# EAGLE design kraken (EAGLE 6.3)
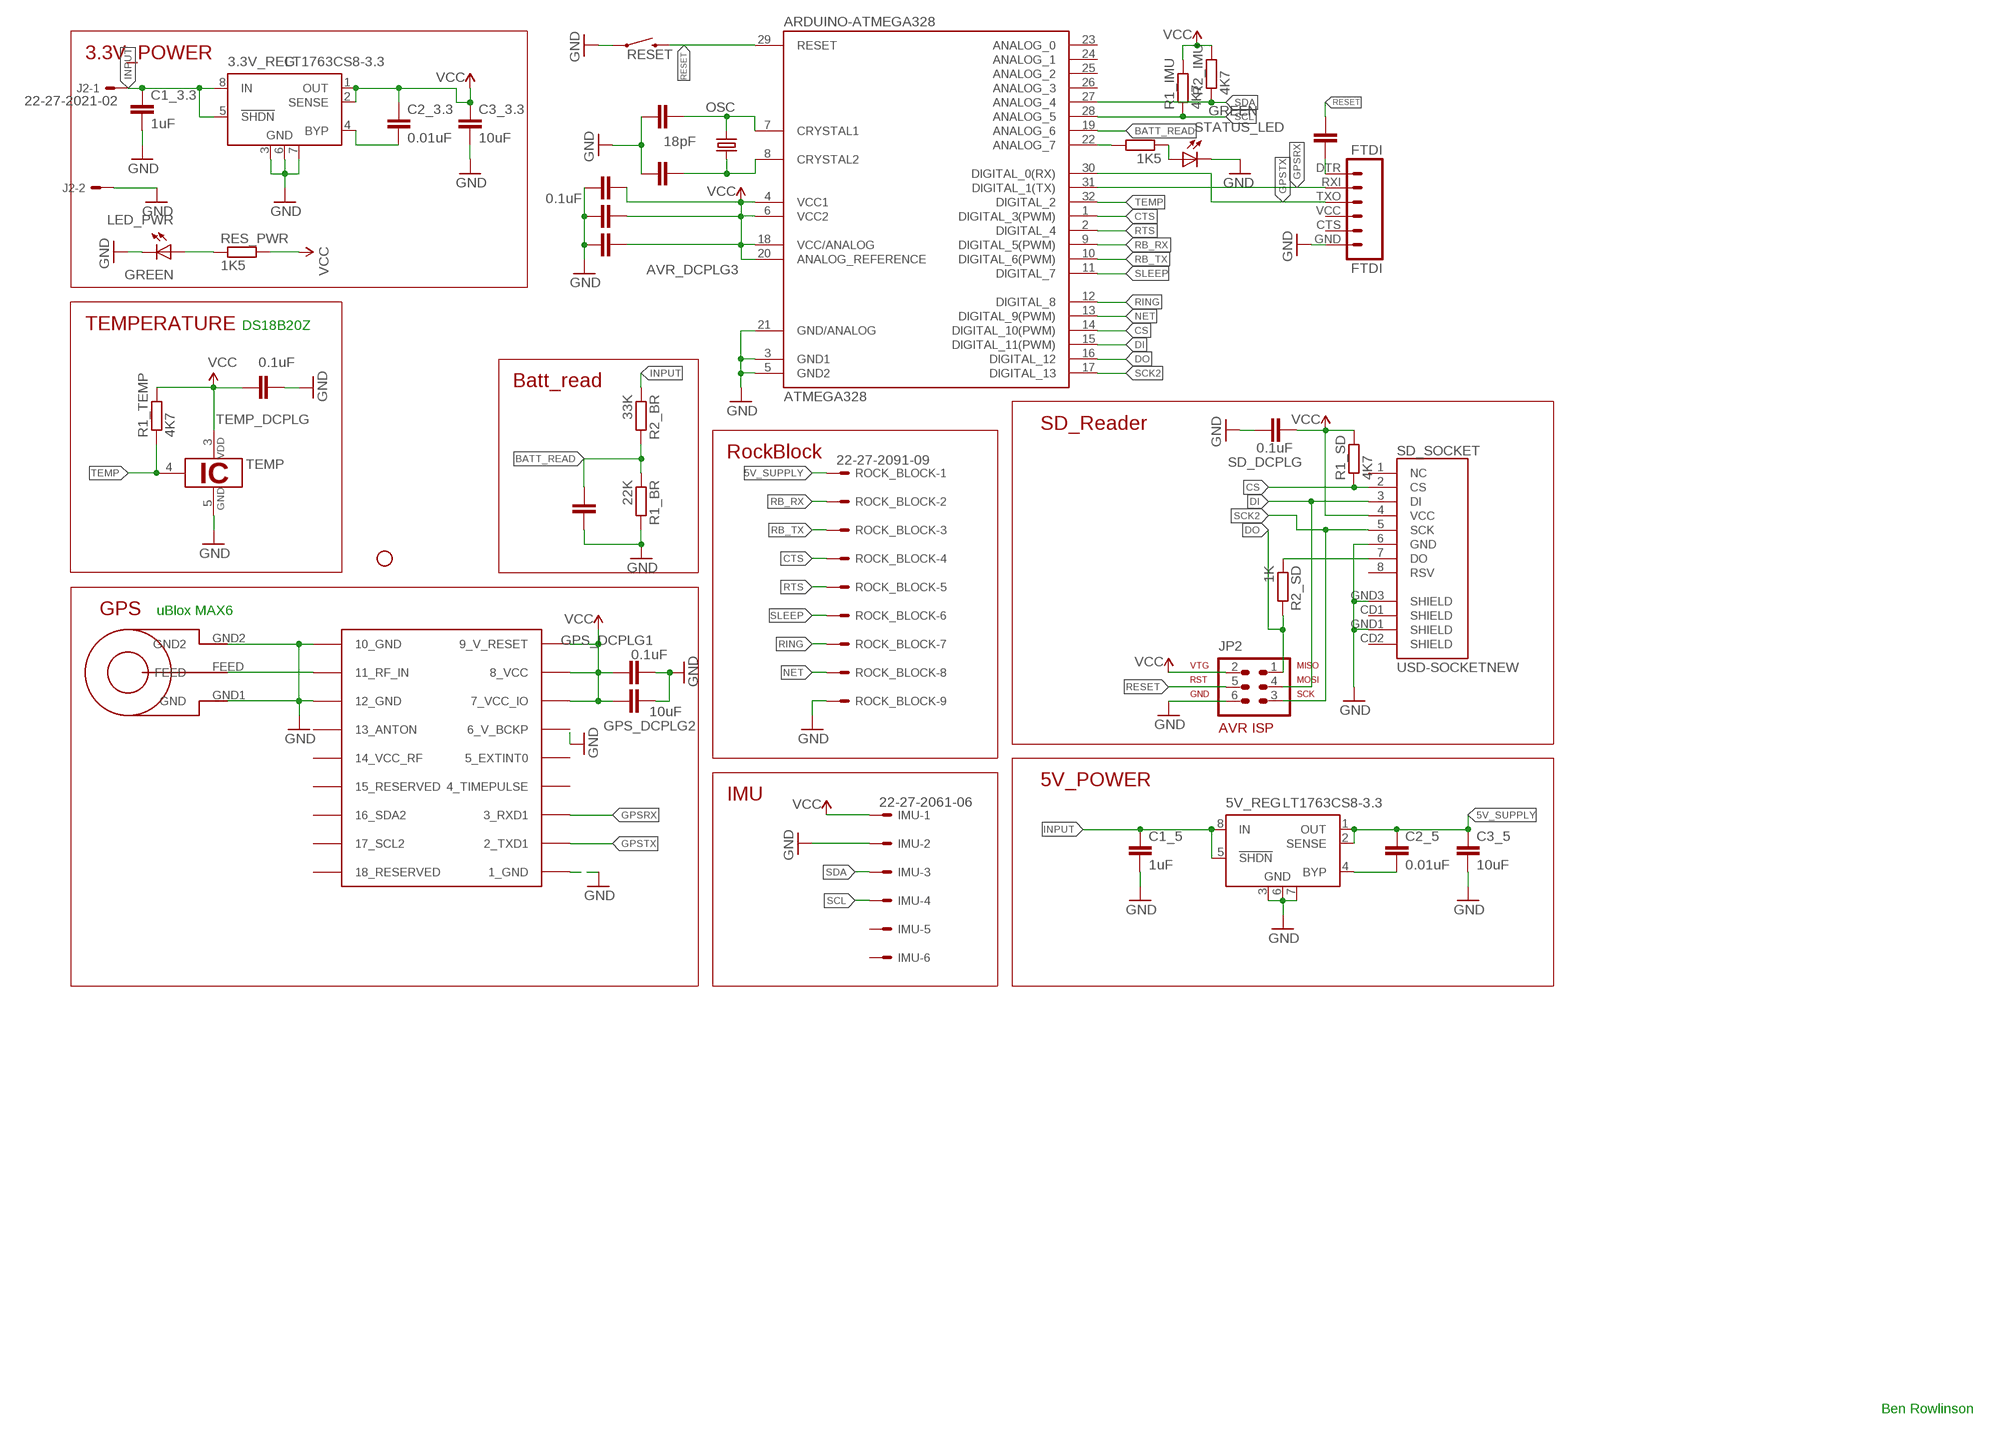
[diagram p0: schematic, sheet 1]

## Parts
3.3V_REG  LT1763CS8-3.3  [SOIC8]
5V_REG  LT1763CS8-3.3  [SOIC8]
ARDUINO-ATMEGA328  ATMEGA328  ATMEGA168-AU  [TQFP32-08]
AVR_DCPLG1  0.1uF  CAP0805  [0805]
AVR_DCPLG2  0.1uF  CAP0805  [0805]
AVR_DCPLG3  0.1uF  CAP0805  [0805]
C1_3.3  1uF  CAP0805  [0805]
C1_5  1uF  CAP0805  [0805]
C1_BR  0.1uF  CAP0805  [0805]
C1_OSC  18pF  CAP0805  [0805]
C2_3.3  0.01uF  CAP0805  [0805]
C2_5  0.01uF  CAP0805  [0805]
C2_OSC  18pF  CAP0805  [0805]
C3_3.3  10uF  CAP0805  [0805]
C3_5  10uF  CAP0805  [0805]
FTDI  FTDI  FTDI_BASICPTH  [FTDI_BASIC]
FTDI_DCPLG  0.1uF  CAP0805  [0805]
GPS_DCPLG1  0.1uF  CAP0805  [0805]
GPS_DCPLG2  10uF  CAP0805  [0805]
IMU  22-27-2061-06  [6410-06]
J2  22-27-2021-02  [6410-02]
JP1  STAND-OFF  [STAND-OFF]
JP2  AVR-ISP-6  [AVR-ISP-6]
LED_PWR  GREEN  LEDCHIPLED_0603  [CHIPLED_0603]
OSC  16MHz  CRYSTAL5X3  [CRYSTAL-SMD-5X3]
R1_BR  22K  R-EU_R0805  [R0805]
R1_IMU  4K7  R-EU_R0805  [R0805]
R1_SD  4K7  R-EU_R0805  [R0805]
R1_TEMP  4K7  R-EU_R0805  [R0805]
R2_BR  33K  R-EU_R0805  [R0805]
R2_IMU  4K7  R-EU_R0805  [R0805]
R2_SD  1K  R-EU_R0805  [R0805]
R_STATUS  1K5  R-EU_R0805  [R0805]
RES_PWR  1K5  R-EU_R0805  [R0805]
RESET  SW-MOMENTARY-SMD  SWITCH-MOMENTARY-2-SMD-1101NE  [TACTILE-SWITCH-1101NE]
ROCK_BLOCK  22-27-2091-09  [6410-09]
SD_DCPLG  0.1uF  CAP0805  [0805]
SD_SOCKET  USD-SOCKETNEW  [MICRO-SD-SOCKET-PP]
STATUS_LED  GREEN  LEDCHIPLED_0603  [CHIPLED_0603]
TEMP  DS18B20Z  [SO08]
TEMP_DCPLG  0.1uF  CAP0805  [0805]
U$1  UBLOX_MAX-6  [UBLOX_MAX-6]
U$2  SARANTEL-SR1202  [SARANTEL-SR1202]

## Nets
5V_SUPPLY: 5V_REG.1(OUT) 5V_REG.2(SENSE) C2_5.1 C3_5.1 ROCK_BLOCK.1
BATT_READ: ARDUINO-ATMEGA328.19(ANALOG_6) C1_BR.2 R1_BR.1 R2_BR.2
CS: ARDUINO-ATMEGA328.14(DIGITAL_10(PWM)) R1_SD.1 SD_SOCKET.2(CS)
CTS: ARDUINO-ATMEGA328.1(DIGITAL_3(PWM)) ROCK_BLOCK.4
DI: ARDUINO-ATMEGA328.15(DIGITAL_11(PWM)) JP2.4 SD_SOCKET.3(DI)
DO: ARDUINO-ATMEGA328.16(DIGITAL_12) JP2.1 R2_SD.2
GND: 3.3V_REG.3(GND) 3.3V_REG.6(GND) 3.3V_REG.7(GND) 5V_REG.3(GND) 5V_REG.6(GND) 5V_REG.7(GND) ARDUINO-ATMEGA328.3(GND1) ARDUINO-ATMEGA328.5(GND2) ARDUINO-ATMEGA328.21(GND/ANALOG) AVR_DCPLG1.1 AVR_DCPLG2.1 AVR_DCPLG3.1 C1_3.3.2 C1_5.2 C1_BR.1 C1_OSC.1 C2_OSC.1 C3_3.3.2 C3_5.2 FTDI.GND GPS_DCPLG1.2 GPS_DCPLG2.2 IMU.2 J2.2 JP2.6 LED_PWR.C R1_BR.2 RESET.P$1 ROCK_BLOCK.9 SD_DCPLG.2 SD_SOCKET.6(GND) SD_SOCKET.GND1(SHIELD) SD_SOCKET.GND3(SHIELD) STATUS_LED.C TEMP.5 TEMP_DCPLG.1 U$1.1_GND U$1.6_V_BCKP U$1.10_GND U$1.12_GND U$2.GND1(GND) U$2.GND2
GPSRX: ARDUINO-ATMEGA328.31(DIGITAL_1(TX)) FTDI.RXI U$1.3_RXD1
GPSTX: ARDUINO-ATMEGA328.30(DIGITAL_0(RX)) FTDI.TXO U$1.2_TXD1
INPUT: 3.3V_REG.5(!SHDN) 3.3V_REG.8(IN) 5V_REG.5(!SHDN) 5V_REG.8(IN) C1_3.3.1 C1_5.1 J2.1 R2_BR.1
N$1: R_STATUS.1 STATUS_LED.A
N$2: R2_SD.1 SD_SOCKET.7(DO)
N$3: LED_PWR.A RES_PWR.1
N$4: ARDUINO-ATMEGA328.22(ANALOG_7) R_STATUS.2
N$5: ARDUINO-ATMEGA328.8(CRYSTAL2) C2_OSC.2 OSC.1
N$6: ARDUINO-ATMEGA328.7(CRYSTAL1) C1_OSC.2 OSC.3
N$7: 3.3V_REG.4(BYP) C2_3.3.2
N$8: U$1.11_RF_IN U$2.FEED
N$10: 5V_REG.4(BYP) C2_5.2
N$14: FTDI.DTR FTDI_DCPLG.2
NET: ARDUINO-ATMEGA328.13(DIGITAL_9(PWM)) ROCK_BLOCK.8
RB_RX: ARDUINO-ATMEGA328.9(DIGITAL_5(PWM)) ROCK_BLOCK.2
RB_TX: ARDUINO-ATMEGA328.10(DIGITAL_6(PWM)) ROCK_BLOCK.3
RESET: ARDUINO-ATMEGA328.29(RESET) FTDI_DCPLG.1 JP2.5 RESET.P$2
RING: ARDUINO-ATMEGA328.12(DIGITAL_8) ROCK_BLOCK.7
RTS: ARDUINO-ATMEGA328.2(DIGITAL_4) ROCK_BLOCK.5
SCK2: ARDUINO-ATMEGA328.17(DIGITAL_13) JP2.3 SD_SOCKET.5(SCK)
SCL: ARDUINO-ATMEGA328.28(ANALOG_5) IMU.4 R1_IMU.1
SDA: ARDUINO-ATMEGA328.27(ANALOG_4) IMU.3 R2_IMU.1
SLEEP: ARDUINO-ATMEGA328.11(DIGITAL_7) ROCK_BLOCK.6
TEMP: ARDUINO-ATMEGA328.32(DIGITAL_2) R1_TEMP.1 TEMP.4
VCC: 3.3V_REG.1(OUT) 3.3V_REG.2(SENSE) ARDUINO-ATMEGA328.4(VCC1) ARDUINO-ATMEGA328.6(VCC2) ARDUINO-ATMEGA328.18(VCC/ANALOG) ARDUINO-ATMEGA328.20(ANALOG_REFERENCE) AVR_DCPLG1.2 AVR_DCPLG2.2 AVR_DCPLG3.2 C2_3.3.1 C3_3.3.1 GPS_DCPLG1.1 GPS_DCPLG2.1 IMU.1 JP2.2 R1_IMU.2 R1_SD.2 R1_TEMP.2 R2_IMU.2 RES_PWR.2 SD_DCPLG.1 SD_SOCKET.4(VCC) TEMP.3 TEMP_DCPLG.2 U$1.7_VCC_IO U$1.8_VCC U$1.9_V_RESET
Unconnected: ARDUINO-ATMEGA328.23(ANALOG_0) ARDUINO-ATMEGA328.24(ANALOG_1) ARDUINO-ATMEGA328.25(ANALOG_2) ARDUINO-ATMEGA328.26(ANALOG_3) FTDI.CTS FTDI.VCC IMU.5 IMU.6 SD_SOCKET.1(NC) SD_SOCKET.8(RSV) SD_SOCKET.CD1(SHIELD) SD_SOCKET.CD2(SHIELD) U$1.4_TIMEPULSE U$1.5_EXTINT0 U$1.13_ANTON U$1.14_VCC_RF U$1.15_RESERVED U$1.16_SDA2 U$1.17_SCL2 U$1.18_RESERVED

## Notes on the sheet
- 3.3V_POWER
- TEMPERATURE | DS18B20Z
- Batt_read
- SD_Reader
- RockBlock
- GPS | uBlox MAX6
- 5V_POWER
- IMU
- Ben Rowlinson

## Library data of the parts
3.3V_REG 5V_REG = linear-technology:LT1763CS8: 500mA, Low Noise, LDO Micropower Regulators Source: http://cds.linear.com/docs/Datasheet/1763ff.pdf; MPN: LT1763CS8-3.3; OC_FARNELL: 1273617; OC_NEWARK: 57M6055
ARDUINO-ATMEGA328 = Arduino-AVR:ATMEGA168
AVR_DCPLG1-AVR_DCPLG3 C1_BR C1_OSC C2_OSC FTDI_DCPLG GPS_DCPLG1 GPS_DCPLG2 SD_DCPLG TEMP_DCPLG = SparkFun:CAP: Capacitor Standard 0603 ceramic capacitor, and 0.1" leaded capacitor.
C1_3.3 C1_5 C2_3.3 C2_5 C3_3.3 C3_5 = apex:CAP: Capacitor Standard 0603 ceramic capacitor, and 0.1" leaded capacitor.
FTDI = apex:FTDI_BASIC: FTDI Basic: 3.3V and 5V
IMU = apex:22-?-06: CONNECTOR wire to board 2.54 mm (.1 inch) pitch header; OC_FARNELL: unknown; OC_NEWARK: unknown
J2 = apex:22-?-02: CONNECTOR wire to board 2.54 mm (.1 inch) pitch header; OC_FARNELL: unknown; OC_NEWARK: unknown
JP1 = apex:STAND-OFF: Stand Off This is the mechanical footprint for a #4 phillips button head screw. Use the keepout ring to avoid running the screw head into surrounding components. SKU : PRT-00447
JP2 = apex:AVR-ISP-6: AVR ISP-6 Serial Programming Header
LED_PWR STATUS_LED = led:LED: LED OSRAM: - CHIPLED LG R971, LG N971, LY N971, LG Q971, LY Q971, LO R971, LY R971 LH N974, LH R974 LS Q976, LO Q976, LY Q976 LO Q996 - Hyper CHIPLED LW Q18S LB Q993, LB Q99A, LB R99A - SideLED LS A670, LO A670, LY A670, LG A670, LP A670 LB A673, LV A673, LT A673, LW A673 LH A674 LY A675 LS A676, LA A676, LO A676, LY A676, LW A676 LS A679, LY A679, LG A679 - Hyper Micro SIDELED® LS Y876, LA Y876, LO Y876, LY Y876 LT Y87S - SmartLED LW L88C, LW L88S LB L89C, LB L89S, LG L890 LS L89K, LO L89K, LY L89K LS L896, LA L896, LO L896, LY L896 - TOPLED LS T670, LO T670, LY T670, LG T670, LP T670 LSG T670, LSP T670, LSY T670, LOP T670, LYG T670 LG T671, LOG T671, LSG T671 LB T673, LV T673, LT T673, LW T673 LH T674 LS T676, LA T676, LO T676, LY T676, LB T676, LH T676, LSB T676, LW T676 LB T67C, LV T67C, LT T67C, LS T67K, LO T67K, LY T67K, LW E67C LS E67B, LA E67B, LO E67B, LY E67B, LB E67C, LV E67C, LT E67C LW T67C LS T679, LY T679, LG T679 LS T770, LO T770, LY T770, LG T770, LP T770 LB T773, LV T773, LT T773, LW T773 LH T774 LS E675, LA E675, LY E675, LS T675 LS T776, LA T776, LO T776, LY T776, LB T776 LHGB T686 LT T68C, LB T68C - Hyper Mini TOPLED® LB M676 - Mini TOPLED Santana® LG M470 LS M47K, LO M47K, LY M47K Source: http://www.osram.convergy.de LUXEON: - LUMILED® LXK2-PW12-R00, LXK2-PW12-S00, LXK2-PW14-U00, LXK2-PW14-V00 LXK2-PM12-R00, LXK2-PM12-S00, LXK2-PM14-U00 LXK2-PE12-Q00, LXK2-PE12-R00, LXK2-PE12-S00, LXK2-PE14-T00, LXK2-PE14-U00 LXK2-PB12-K00, LXK2-PB12-L00, LXK2-PB12-M00, LXK2-PB14-N00, LXK2-PB14-P00, LXK2-PB14-Q00 LXK2-PR12-L00, LXK2-PR12-M00, LXK2-PR14-Q00, LXK2-PR14-R00 LXK2-PD12-Q00, LXK2-PD12-R00, LXK2-PD12-S00 LXK2-PH12-R00, LXK2-PH12-S00 LXK2-PL12-P00, LXK2-PL12-Q00, LXK2-PL12-R00 Source: www.luxeon.com KINGBRIGHT: KA-3528ASYC Source: www.kingbright.com
OSC = SparkFun:CRYSTAL: Crystals Various standard crystals. Proven footprints. Spark Fun Electronics SKU : COM-00534
R1_BR R1_IMU R1_SD R1_TEMP R2_BR R2_IMU R2_SD R_STATUS RES_PWR = apex:R-EU_: RESISTOR, European symbol
RESET = SparkFun:SWITCH-MOMENTARY-2
ROCK_BLOCK = apex:22-?-09: CONNECTOR wire to board 2.54 mm (.1 inch) pitch header; OC_FARNELL: unknown; OC_NEWARK: unknown
SD_SOCKET = SparkFun-Connectors:USD-SOCKET: microSD Socket Push-push type uSD socket. Schematic element and footprint production proven. Spark Fun Electronics SKU : PRT-00127. tDoc lines correctly indicate media card edge positions when inserting (unlocked, locked, depressed).
TEMP = 1wire:DS18B20: Programmable Resolution Digital Thermometer This chip provides a onewire thermosensor with approx. 0.5°C accuracy. A programmable over/undertemperure alarm is available. The precision can be set from 9..12 bits. Notes: Vdd must be applied for accurate measurements at low temperatures, as the parasite power circuit otherwise heats the sensor. If parasite power is used, Vdd has to be connected to GND. The DS1822 is a low-cost thermometer chip, the DS18S20 is similar to the DS18B20, but with 9 Bit precision only. Author: Jan Kandziora <jjj@gmx.de>
U$1 = apex:UBLOX_MAX-6: UBLOX MAX-6
U$2 = apex:SARANTEL-SR1202: SARANTEL-SL1202 Author Anthony Stirk / http://ava.upuaut.net Data Sheet : http://docs-europe.electrocomponents.com/webdocs/0dbd/0900766b80dbde80.pdf

## Board
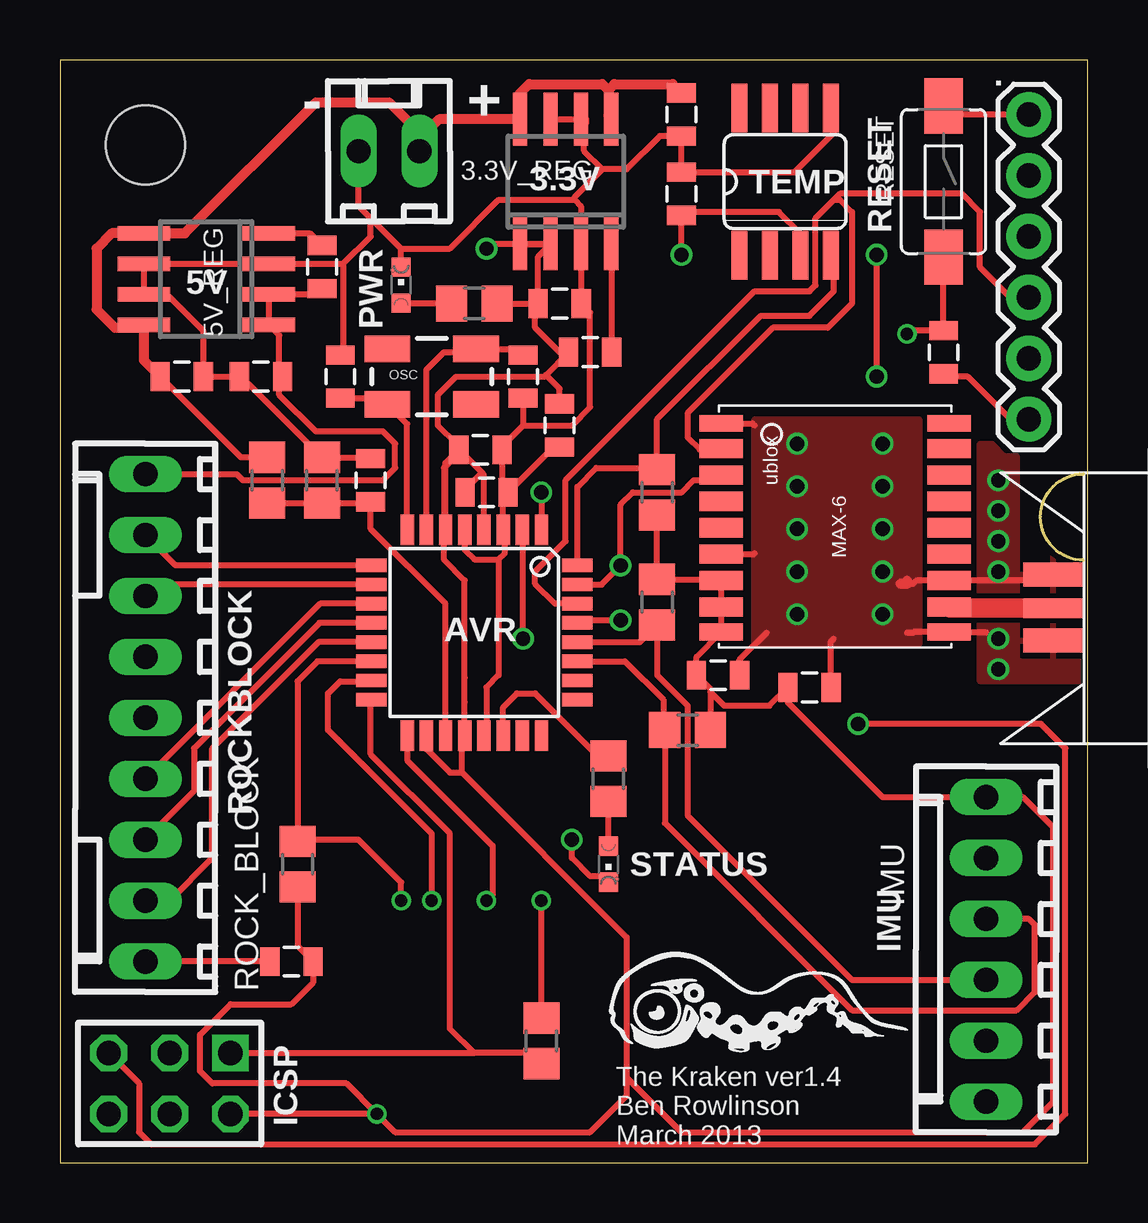
[diagram p1: board, top side]
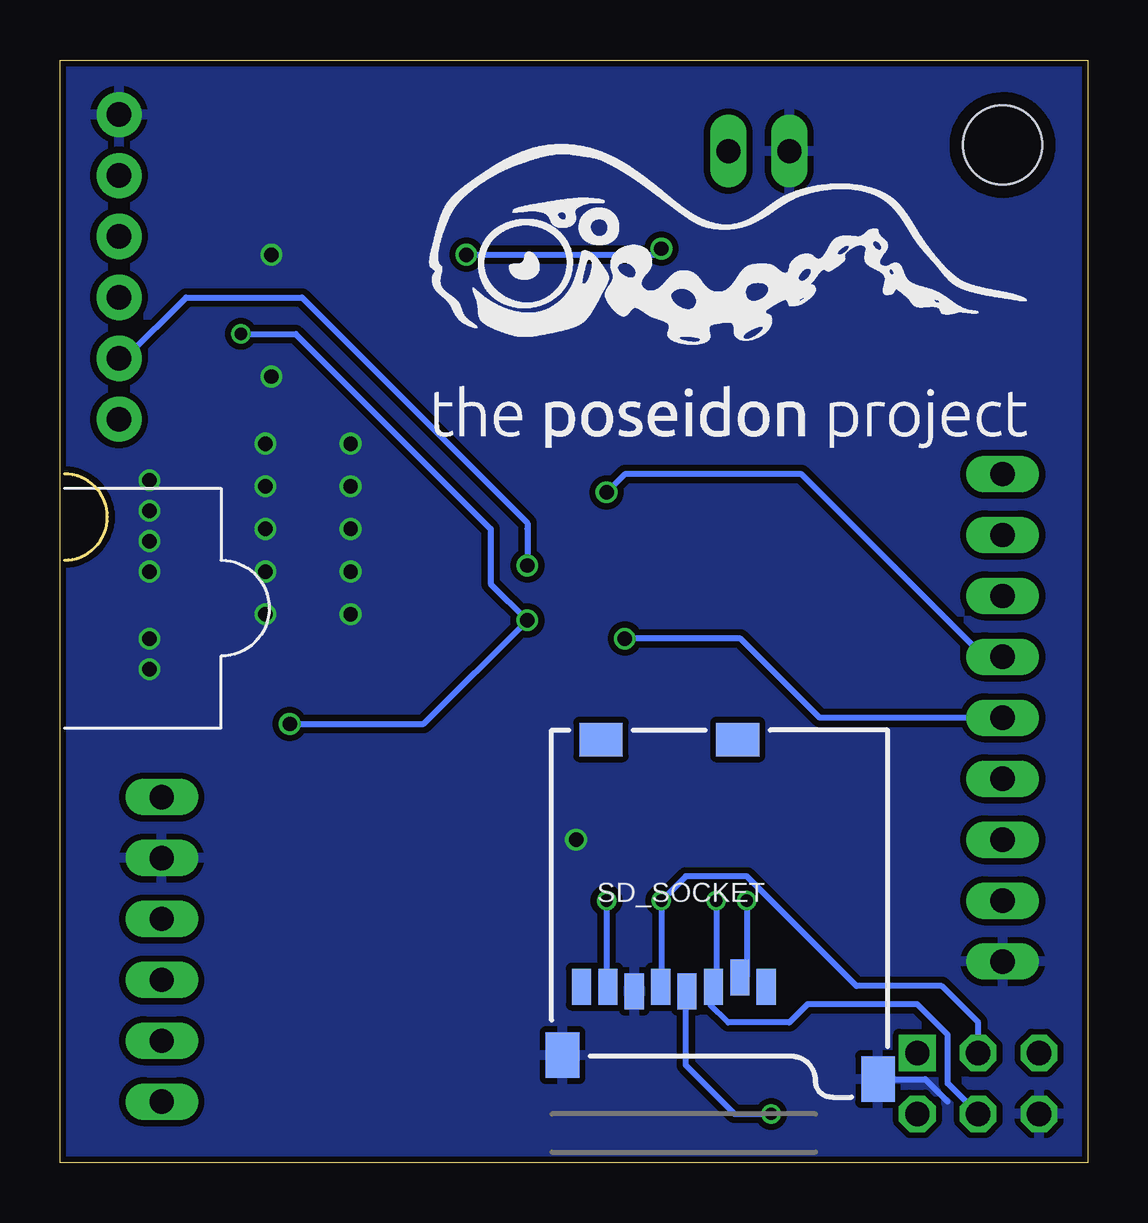
[diagram p2: board, bottom side, seen from below]

Size 42.85 x 45.96 mm. Coordinates in mm from the lower left corner, seen from the top.
Outline: 0,0 42.85,0 42.85,45.96 0,45.96 0,0
Copper layers (1*16): Top 0.035mm / dielectric 1.5mm / Bottom 0.035mm
Design rules "Poseidon DRC": minimum track width 10mil, minimum drill 12mil, track to track 8mil, track to pad 6mil, pad to pad 6mil, via to via 6mil, smd to smd 0mil, copper to edge 10mil, drill to drill 10mil, minimum pad ring 10mil, minimum via ring 6mil, stop-mask expansion 2mil, vias tented up to drill 100mil, thermal gap 10mil

### Footprints (pad centres in the part's own frame; a part is rotated, then mirrored left to right if it is on the bottom)
SOIC8 = smd 0.6 x 2.2: 1 -1.905,-2.6; 2 -0.635,-2.6; 3 0.635,-2.6; 4 1.905,-2.6; 5 1.905,2.6; 6 0.635,2.6; 7 -0.635,2.6; 8 -1.905,2.6
TQFP32-08 = smd 1.27 x 0.559: 1 -4.293,2.8; 2 -4.293,2; 3 -4.293,1.2; 4 -4.293,0.4; 5 -4.293,-0.4; 6 -4.293,-1.2; 7 -4.293,-2; 8 -4.293,-2.8; 17 4.293,-2.8; 18 4.293,-2; 19 4.293,-1.2; 20 4.293,-0.4; 21 4.293,0.4; 22 4.293,1.2; 23 4.293,2; 24 4.293,2.8 | smd 0.559 x 1.27: 9 -2.8,-4.293; 10 -2,-4.293; 11 -1.2,-4.293; 12 -0.4,-4.293; 13 0.4,-4.293; 14 1.2,-4.293; 15 2,-4.293; 16 2.8,-4.293; 25 2.8,4.293; 26 2,4.293; 27 1.2,4.293; 28 0.4,4.293; 29 -0.4,4.293; 30 -1.2,4.293; 31 -2,4.293; 32 -2.8,4.293
0805 = smd 0.8 x 1.2: 1 -0.9,0; 2 0.9,0
FTDI_BASIC = drill 1.016 pad 1.88: CTS 10.16,0; DTR 0,0; GND 12.7,0; RXI 2.54,0; TXO 5.08,0; VCC 7.62,0
6410-06 = drill 1.016 long: 1 6.35,0; 2 3.81,0; 3 1.27,0; 4 -1.27,0; 5 -3.81,0; 6 -6.35,0
6410-02 = drill 1.016 long: 1 1.27,0; 2 -1.27,0
STAND-OFF = hole 3.302: 0,0
AVR-ISP-6 = drill 1.016 square: 1 -2.54,-1.27 | drill 1.016 octagon: 2 -2.54,1.27; 3 0,-1.27; 4 0,1.27; 5 2.54,-1.27; 6 2.54,1.27
CHIPLED_0603 = smd 0.8 x 0.8: A 0,-0.75; C 0,0.75
CRYSTAL-SMD-5X3 = smd 1.9 x 1.1: 1 -1.85,-1.15; 2 1.85,-1.15; 3 1.85,1.15; 4 -1.85,1.15
R0805 = smd 1.3 x 1.5: 1 -0.95,0; 2 0.95,0
TACTILE-SWITCH-1101NE = smd 2.3 x 1.6: P$1 -3.15,0; P$2 3.15,0
6410-09 = drill 1.016 long: 1 10.16,0; 2 7.62,0; 3 5.08,0; 4 2.54,0; 5 0,0; 6 -2.54,0; 7 -5.08,0; 8 -7.62,0; 9 -10.16,0
MICRO-SD-SOCKET-PP = smd 0.8 x 1.5: 1 -8.94,10.7; 2 -7.84,10.3; 3 -6.74,10.7; 4 -5.64,10.9; 5 -4.54,10.7; 6 -3.44,10.9; 7 -2.34,10.7; 8 -1.24,10.7 | smd 1.8 x 1.4: CD1 -2.05,0.4; CD2 -7.75,0.4 | smd 1.4 x 1.9: GND1 -13.6,14.55; GND3 -0.45,13.55
SO08 = smd 0.66 x 2.032: 1 -1.905,-3.073; 2 -0.635,-3.073; 3 0.635,-3.073; 4 1.905,-3.073; 5 1.905,3.073; 6 0.635,3.073; 7 -0.635,3.073; 8 -1.905,3.073
UBLOX_MAX-6 = smd 1.8 x 0.7: 1_GND 4.95,-4.4; 9_V_RESET 4.95,4.3; 10_GND -4.55,4.3; 18_RESERVED -4.55,-4.4 | smd 1.8 x 0.8: 2_TXD1 4.95,-3.35; 3_RXD1 4.95,-2.25; 4_TIMEPULSE 4.95,-1.15; 5_EXTINT0 4.95,-0.05; 6_V_BCKP 4.95,1.05; 7_VCC_IO 4.95,2.15; 8_VCC 4.95,3.25; 11_RF_IN -4.55,3.25; 12_GND -4.55,2.15; 13_ANTON -4.55,1.05; 14_VCC_RF -4.55,-0.05; 15_RESERVED -4.55,-1.15; 16_SDA2 -4.55,-2.25; 17_SCL2 -4.55,-3.35
SARANTEL-SR1202 = smd 2.5 x 0.8: FEED 0,0 | smd 2.5 x 1: GND1 0,1.4; GND2 0,-1.35

### Placement (x,y rotation side)
3.3V_REG  21.08,40.89 0 top
5V_REG  6.1,36.83 90 top
ARDUINO-ATMEGA328  17.27,22.1 270 top
AVR_DCPLG1  17.53,29.72 180 top
AVR_DCPLG2  17.78,27.94 180 top
AVR_DCPLG3  20.83,30.73 90 top
C1_3.3  25.91,43.69 270 top
C1_5  5.08,32.77 0 top
C1_BR  12.95,28.45 270 top
C1_OSC  19.3,32.77 90 top
C2_3.3  22.1,33.78 0 top
C2_5  10.92,37.34 90 top
C2_OSC  11.68,32.77 270 top
C3_3.3  20.83,35.81 0 top
C3_5  8.38,32.77 180 top
FTDI  40.39,30.99 90 top
FTDI_DCPLG  36.83,33.78 270 top
GPS_DCPLG1  27.43,20.32 0 top
GPS_DCPLG2  31.24,19.81 0 top
IMU  38.61,8.89 90 top
J2  13.72,42.16 0 top
JP1  3.56,42.42 0 top
JP2  4.57,3.3 180 top
LED_PWR  14.22,36.58 0 top
OSC  15.49,32.77 0 top
R1_BR  10.92,28.45 90 top
R1_IMU  24.89,23.37 90 top
R1_SD  9.91,12.45 270 top
R1_TEMP  24.89,27.94 270 top
R2_BR  8.64,28.45 270 top
R2_IMU  26.16,18.03 0 top
R2_SD  20.07,5.08 270 top
R_STATUS  22.86,16 90 top
RES_PWR  17.27,35.81 0 top
RESET  36.83,40.89 270 top
ROCK_BLOCK  3.56,18.54 90 top
SD_DCPLG  9.65,8.38 180 top
SD_SOCKET  22.35,18.03 180 bottom
STATUS_LED  22.86,12.45 180 top
TEMP  30.23,40.89 0 top
TEMP_DCPLG  25.91,40.39 270 top
U$1  32.51,26.42 180 top
U$2  41.4,23.11 0 top

### Tracks (layer width: path | path; a pad name or v marks a point on that pad's centre or on a via)
5V_SUPPLY
  Top 0.254: C2_5.1 10.68,36.2 5V_REG.2 5V_REG.1 9.14,34.48 9.14,33.02 9.28,32.88 C3_5.1 9.14,32.63 9.14,32 10.67,30.48 13.46,30.48 13.97,29.97 13.97,28.96 13.46,28.45 7.62,28.45 7.37,28.7 ROCK_BLOCK.1
BATT_READ
  Top 0.254: R2_BR.2 R1_BR.1 12.9,27.5 C1_BR.2 12.95,26.42 16.07,23.3 ARDUINO-ATMEGA328.19
CS  (via drill 0.51)
  Top 0.254: ARDUINO-ATMEGA328.14 10.74,20.9 9.91,20.07 R1_SD.1 9.97,13.46 12.45,13.46 14.22,11.68 v14.22,10.92
  Bottom 0.254: v14.22,10.92 14.22,7.77 14.26,7.73 SD_SOCKET.2
CTS  (via drill 0.6)
  Top 0.254: v20.07,27.94 ARDUINO-ATMEGA328.1
  Bottom 0.254: ROCK_BLOCK.4 4.32,21.08 11.94,28.7 19.3,28.7 v20.07,27.94
DI  (via drill 0.51)
  Top 0.254: ARDUINO-ATMEGA328.15 12.95,20.07 11.68,20.07 11.18,19.56 11.18,18.03 15.49,13.72 v15.49,10.92
  Bottom 0.254: JP2.4 5.84,3.3 5.84,5.33 7.11,6.6 11.68,6.6 12.45,5.84 14.99,5.84 15.75,6.6 15.75,7.2 SD_SOCKET.3 15.61,7.35 15.49,7.47 v15.49,10.92
DO
  Top 0.254: JP2.1 17.27,4.57 | R2_SD.2 19.62,4.57 17.27,4.57 | 17.27,4.57 16.26,5.59 16.26,13.72 12.95,17.02 12.95,19.27 ARDUINO-ATMEGA328.16
GND  (via drill 0.6)
  Top 0.254: 22.61,41.4 23.62,41.4 25.01,42.79 C1_3.3.2 TEMP_DCPLG.1 30.62,41.29 32.26,42.93 32.26,43.84 TEMP.5 | 22.61,41.4 21.84,42.16 21.84,43.37 | LED_PWR.C 14.22,38.1 | 14.22,38.1 12.95,39.37 | J2.2 12.45,39.88 12.95,39.37 | 14.22,38.1 16.26,38.1 18.29,40.13 21.46,40.13 | 21.46,40.13 21.72,39.88 3.3V_REG.3 C3_3.3.2 22.1,35.44 22.1,31.5 21.34,30.73 19.3,30.73 | 11.81,37.46 5V_REG.3 5V_REG.6 5V_REG.7 3.62,36.32 4.32,36.32 5.98,34.66 C1_5.2 C3_5.2 7.55,32.77 R1_BR.2 12.9,29.4 C1_BR.1 | 11.81,37.46 12.95,38.61 12.95,39.37 | 3.3V_REG.7 3.3V_REG.6 | 21.46,40.13 21.46,40.26 22.61,41.4 | 11.81,37.46 11.81,33.79 C2_OSC.1 | 19.3,30.73 18.43,29.86 AVR_DCPLG1.1 18.43,28.19 AVR_DCPLG2.1 | ARDUINO-ATMEGA328.5 16.87,25.55 17.27,25.15 18.29,25.15 | 18.29,25.15 18.54,25.4 18.54,26.32 ARDUINO-ATMEGA328.3 18.47,27.73 AVR_DCPLG2.1 | 18.29,25.15 18.29,20.32 17.78,19.81 17.78,17.91 ARDUINO-ATMEGA328.21 | AVR_DCPLG3.1 20.57,29.83 AVR_DCPLG2.1 | C1_OSC.1 19.3,30.73 | GPS_DCPLG1.2 28.33,20.97 29.46,22.1 | 35.05,24.13 35.56,24.13 35.7,24.27 U$1.12_GND 40.39,24.27 40.64,24.51 U$2.GND1 | 35.31,22.1 35.56,22.1 35.58,22.12 U$1.10_GND 38.59,22.12 38.61,22.1 | FTDI.GND 37.19,43.69 RESET.P$1 | STATUS_LED.C 22.86,11.94 22.1,11.94 21.34,12.7 v21.34,13.46 | v34.04,37.85 v34.04,32.77 | GPS_DCPLG2.2 32.14,21.73 32.26,21.84 | U$1.6_V_BCKP 28.92,25.37 28.96,25.4 | U$1.1_GND 28.87,30.82 28.96,30.73 | SD_DCPLG.2 ROCK_BLOCK.9
  Top 0.406: 35.31,24.27 35.31,24.13 35.05,24.13 | 3.3V_REG.6 21.84,43.49 21.84,43.37
  Bottom 0.254: 21.84,4.43 SD_SOCKET.GND3 | SD_SOCKET.GND1 6.79,3.48 5.84,2.54
  other vias: 34.29,29.97 30.73,29.97 30.73,28.19 34.29,28.19 34.29,26.42 30.73,26.42 34.29,24.64 30.73,24.64 30.73,22.86 34.29,22.86 39.12,21.84 39.12,24.64 39.12,25.91 39.12,27.18 39.12,28.45 39.12,20.57
  pour Bottom (isolate 0.254): -1.78,46.23 43.18,46.23 42.67,0 -1.78,0
  pour Top (no thermals): 28.96,30.99 35.81,30.99 35.81,21.59 28.96,21.59
  pour Bottom (no thermals): 36.83,31.5 31.24,31.5 28.7,28.96 28.7,21.59 28.96,21.34 35.56,21.34 36.32,19.81 42.42,19.81 42.42,29.21 39.12,29.21
  pour Top (no thermals): 38.35,29.97 38.86,29.97 39.37,29.46 39.88,29.46 39.88,20.07 38.35,20.07
  pour Top: 39.88,29.46 42.67,29.46 42.67,20.07 39.88,20.07
GPSRX  (via drill 0.6)
  Top 0.254: ARDUINO-ATMEGA328.31 22.57,24.1 v23.37,24.89 23.37,27.43 23.88,27.94 25.91,27.94 26.42,28.45 27.34,28.45 U$1.3_RXD1
  Bottom 0.254: 23.37,26.42 v23.37,24.89 23.37,26.67 32.77,36.07 37.59,36.07 40.13,33.53 FTDI.RXI
GPSTX
  Top 0.254: ARDUINO-ATMEGA328.30 20.64,23.3 19.81,24.13 19.81,24.64 21.08,25.91 21.08,28.45 28.96,36.32 31.24,36.32 31.5,36.58 31.5,39.37 32.26,40.13 | 32.26,40.13 32.51,40.13 33.02,39.62 33.02,35.81 32,34.8 29.72,34.8 26.16,31.24 26.16,30.23 26.67,29.72 27.51,29.72 U$1.2_TXD1 | FTDI.TXO 39.62,36.07 38.35,37.34 38.35,39.62 37.59,40.39 32.51,40.39 32.26,40.13
INPUT
  Top 0.254: R2_BR.1 7.55,29.4 C1_5.1
  Top 0.406: C1_5.1 3.5,33.45 5V_REG.8 3.37,34.8 2.29,34.8 1.52,35.56 1.52,38.1 2.16,38.73 5V_REG.5 5.21,38.73 10.67,44.2 13.72,44.2 14.99,42.93 14.99,42.67 | 14.99,42.67 J2.1 | 14.99,42.67 15.81,43.49 3.3V_REG.8 19.18,44.58 19.56,44.96 22.61,44.96 22.86,44.7 | 22.86,44.7 22.86,43.62 3.3V_REG.5 | 22.86,44.7 23.11,44.96 25.54,44.96 C1_3.3.1
N$1
  Top 0.254: STATUS_LED.A R_STATUS.1
N$2  (via drill 0.51)
  Top 0.254: R2_SD.1 v20.07,10.92
  Bottom 0.254: v20.07,10.92 20.07,7.39 SD_SOCKET.7
N$3
  Top 0.254: RES_PWR.1 14.24,35.81 LED_PWR.A
N$4
  Top 0.254: ARDUINO-ATMEGA328.22 18.47,18.98 19.05,19.56 19.81,19.56 22.35,17.02 22.79,17.02 R_STATUS.2
N$5
  Top 0.254: C2_OSC.2 13.39,31.87 OSC.1 14.47,30.79 ARDUINO-ATMEGA328.8
N$6
  Top 0.254: C1_OSC.2 19.05,33.92 OSC.3 17.21,33.78 16,33.78 15.27,33.05 ARDUINO-ATMEGA328.7
N$7
  Top 0.254: 3.3V_REG.4 C2_3.3.2
N$8
  Top 0.813: U$2.FEED 37.11,23.11 U$1.11_RF_IN
N$10
  Top 0.254: 5V_REG.4 10.42,38.73 C2_5.2
N$14
  Top 0.254: FTDI.DTR 39.62,30.99 37.85,32.77 36.95,32.77 FTDI_DCPLG.2
NET
  Top 0.254: ARDUINO-ATMEGA328.13 10.78,21.7 6.35,17.27 6.35,12.7 4.57,10.92 ROCK_BLOCK.8
RB_RX
  Top 0.254: ARDUINO-ATMEGA328.9 4.82,24.9 ROCK_BLOCK.2
RB_TX
  Top 0.254: ARDUINO-ATMEGA328.10 4.03,24.1 ROCK_BLOCK.3
RESET  (via drill 0.51, 0.6)
  Top 0.254: JP2.5 3.3,3.3 3.3,1.27 3.81,0.76 40.64,0.76 41.91,2.03 41.91,17.27 40.89,18.29 v33.27,18.29 | v23.37,22.61 21.67,22.61 ARDUINO-ATMEGA328.29 | RESET.P$2 FTDI_DCPLG.1 35.44,34.68 v35.31,34.54
  Bottom 0.254: v33.27,18.29 27.69,18.29 v23.37,22.61 24.89,24.13 24.89,26.42 33.02,34.54 v35.31,34.54
RING
  Top 0.254: ARDUINO-ATMEGA328.12 10.81,22.5 5.59,17.27 5.59,15.49 ROCK_BLOCK.7
RTS  (via drill 0.6)
  Top 0.254: ARDUINO-ATMEGA328.2 19.27,21.88 v19.3,21.84
  Bottom 0.254: ROCK_BLOCK.5 11.18,18.54 14.48,21.84 v19.3,21.84
SCK2  (via drill 0.51)
  Top 0.254: ARDUINO-ATMEGA328.17 14.47,16.77 18.03,13.21 18.03,11.18 v17.78,10.92
  Bottom 0.254: SD_SOCKET.5 17.78,7.37 v17.78,10.92 16.76,11.94 14.22,11.94 9.65,7.37 6.1,7.37 4.57,5.84 JP2.3
SCL
  Top 0.254: ARDUINO-ATMEGA328.28 24.17,21.7 R1_IMU.1 24.89,20.32 26.16,19.05 26.16,14.48 33.02,7.62 IMU.4
SDA
  Top 0.254: ARDUINO-ATMEGA328.27 23.55,20.9 25.15,19.3 25.15,18.1 R2_IMU.1 25.21,14.16 33.02,6.35 39.88,6.35 40.64,7.11 40.64,9.91 40.39,10.16 IMU.3
SLEEP
  Top 0.254: ARDUINO-ATMEGA328.11 10.85,23.3 ROCK_BLOCK.6
TEMP
  Top 0.254: TEMP.4 32.26,37.69 32.26,36.32 31.24,35.31 29.21,35.31 24.89,30.99 R1_TEMP.1 24.83,28.96 22.35,28.96 21.57,28.17 ARDUINO-ATMEGA328.32
VCC  (via drill 0.51, 0.6)
  Top 0.254: 3.3V_REG.1 3.3V_REG.2 | C3_3.3.1 19.81,35.7 19.81,34.8 20.83,33.78 C2_3.3.1 20.25,32.84 | RES_PWR.2 C3_3.3.1 | AVR_DCPLG1.2 16.07,29.16 ARDUINO-ATMEGA328.6 16,26.32 | ARDUINO-ATMEGA328.4 17.67,28.67 17.58,28.76 | 17.58,28.76 AVR_DCPLG1.2 | AVR_DCPLG1.2 16.63,29.86 16.51,29.97 | 20.18,32.77 16.51,32.77 15.75,32 15.75,30.73 16.51,29.97 | 20.18,32.77 20.25,32.84 | AVR_DCPLG2.2 16.88,28.06 17.58,28.76 | ARDUINO-ATMEGA328.20 16.87,24.28 16,25.15 16,26.32 | ARDUINO-ATMEGA328.20 16.87,19.2 | TEMP.3 30.86,38.73 29.97,39.62 26.05,39.62 TEMP_DCPLG.2 v25.91,37.85 | 20.32,32.77 20.25,32.84 | 27.11,19.62 R2_IMU.2 | 27.11,19.62 27.11,19.74 GPS_DCPLG1.1 26.53,21.09 U$1.9_V_RESET U$1.8_VCC U$1.7_VCC_IO 27.51,24.32 R1_IMU.2 R1_TEMP.2 | 27.11,19.62 27.69,19.05 29.58,19.05 GPS_DCPLG2.1 30.34,19.19 34.29,15.24 IMU.1 40.13,15.24 41.4,13.97 41.4,2.54 40.13,1.27 25.91,1.27 23.62,3.56 | ARDUINO-ATMEGA328.20 16.87,20.21 | 15.24,17.84 ARDUINO-ATMEGA328.18 15.27,17.24 16.26,16.26 16.76,16.26 | C3_3.3.1 19.93,37.77 3.3V_REG.2 | 3.3V_REG.2 17.97,38.29 v17.78,38.1 | 23.62,3.56 23.62,2.79 22.1,1.27 13.97,1.27 v13.21,2.03 | AVR_DCPLG3.2 20.83,32.26 20.32,32.77 | 20.32,32.77 20.18,32.77 | 16.51,29.97 16.51,29.46 16,28.96 16,26.32 | 16.76,16.26 23.62,9.4 23.62,3.56 | R1_SD.2 9.91,9.03 SD_DCPLG.1 10.55,7.5 9.65,6.6 7.11,6.6 5.84,5.33 5.84,3.81 6.35,3.3 11.94,3.3 v13.21,2.03 | 16.76,16.26 16.76,17.7 ARDUINO-ATMEGA328.20 | v13.21,2.03 JP2.2
  Bottom 0.254: SD_SOCKET.4 16.76,7.08 16.76,4.06 14.73,2.03 v13.21,2.03 | v25.91,37.85 18.03,37.85 v17.78,38.1

### Text on the board
tPlace: - | + | . | RESET | 3.3V | TEMP | PWR | 5V | AVR | ROCKBLOCK | STATUS | IMU | ICSP | The Kraken ver1.4 / Ben Rowlinson / March 2013 | G:/Poseidon/PoseidonEagle.bmp | G:/Poseidon/PoseidonEagle.bmp | G:/Poseidon/PoseidonEagle.bmp | G:/Poseidon/PoseidonEagle.bmp | G:/Poseidon/PoseidonEagle.bmp | G:/Poseidon/PoseidonEagle.bmp